# EAGLE design KMO_IO_MV2_9_min (EAGLE 9.5.1)

## Sheet 1 of 2
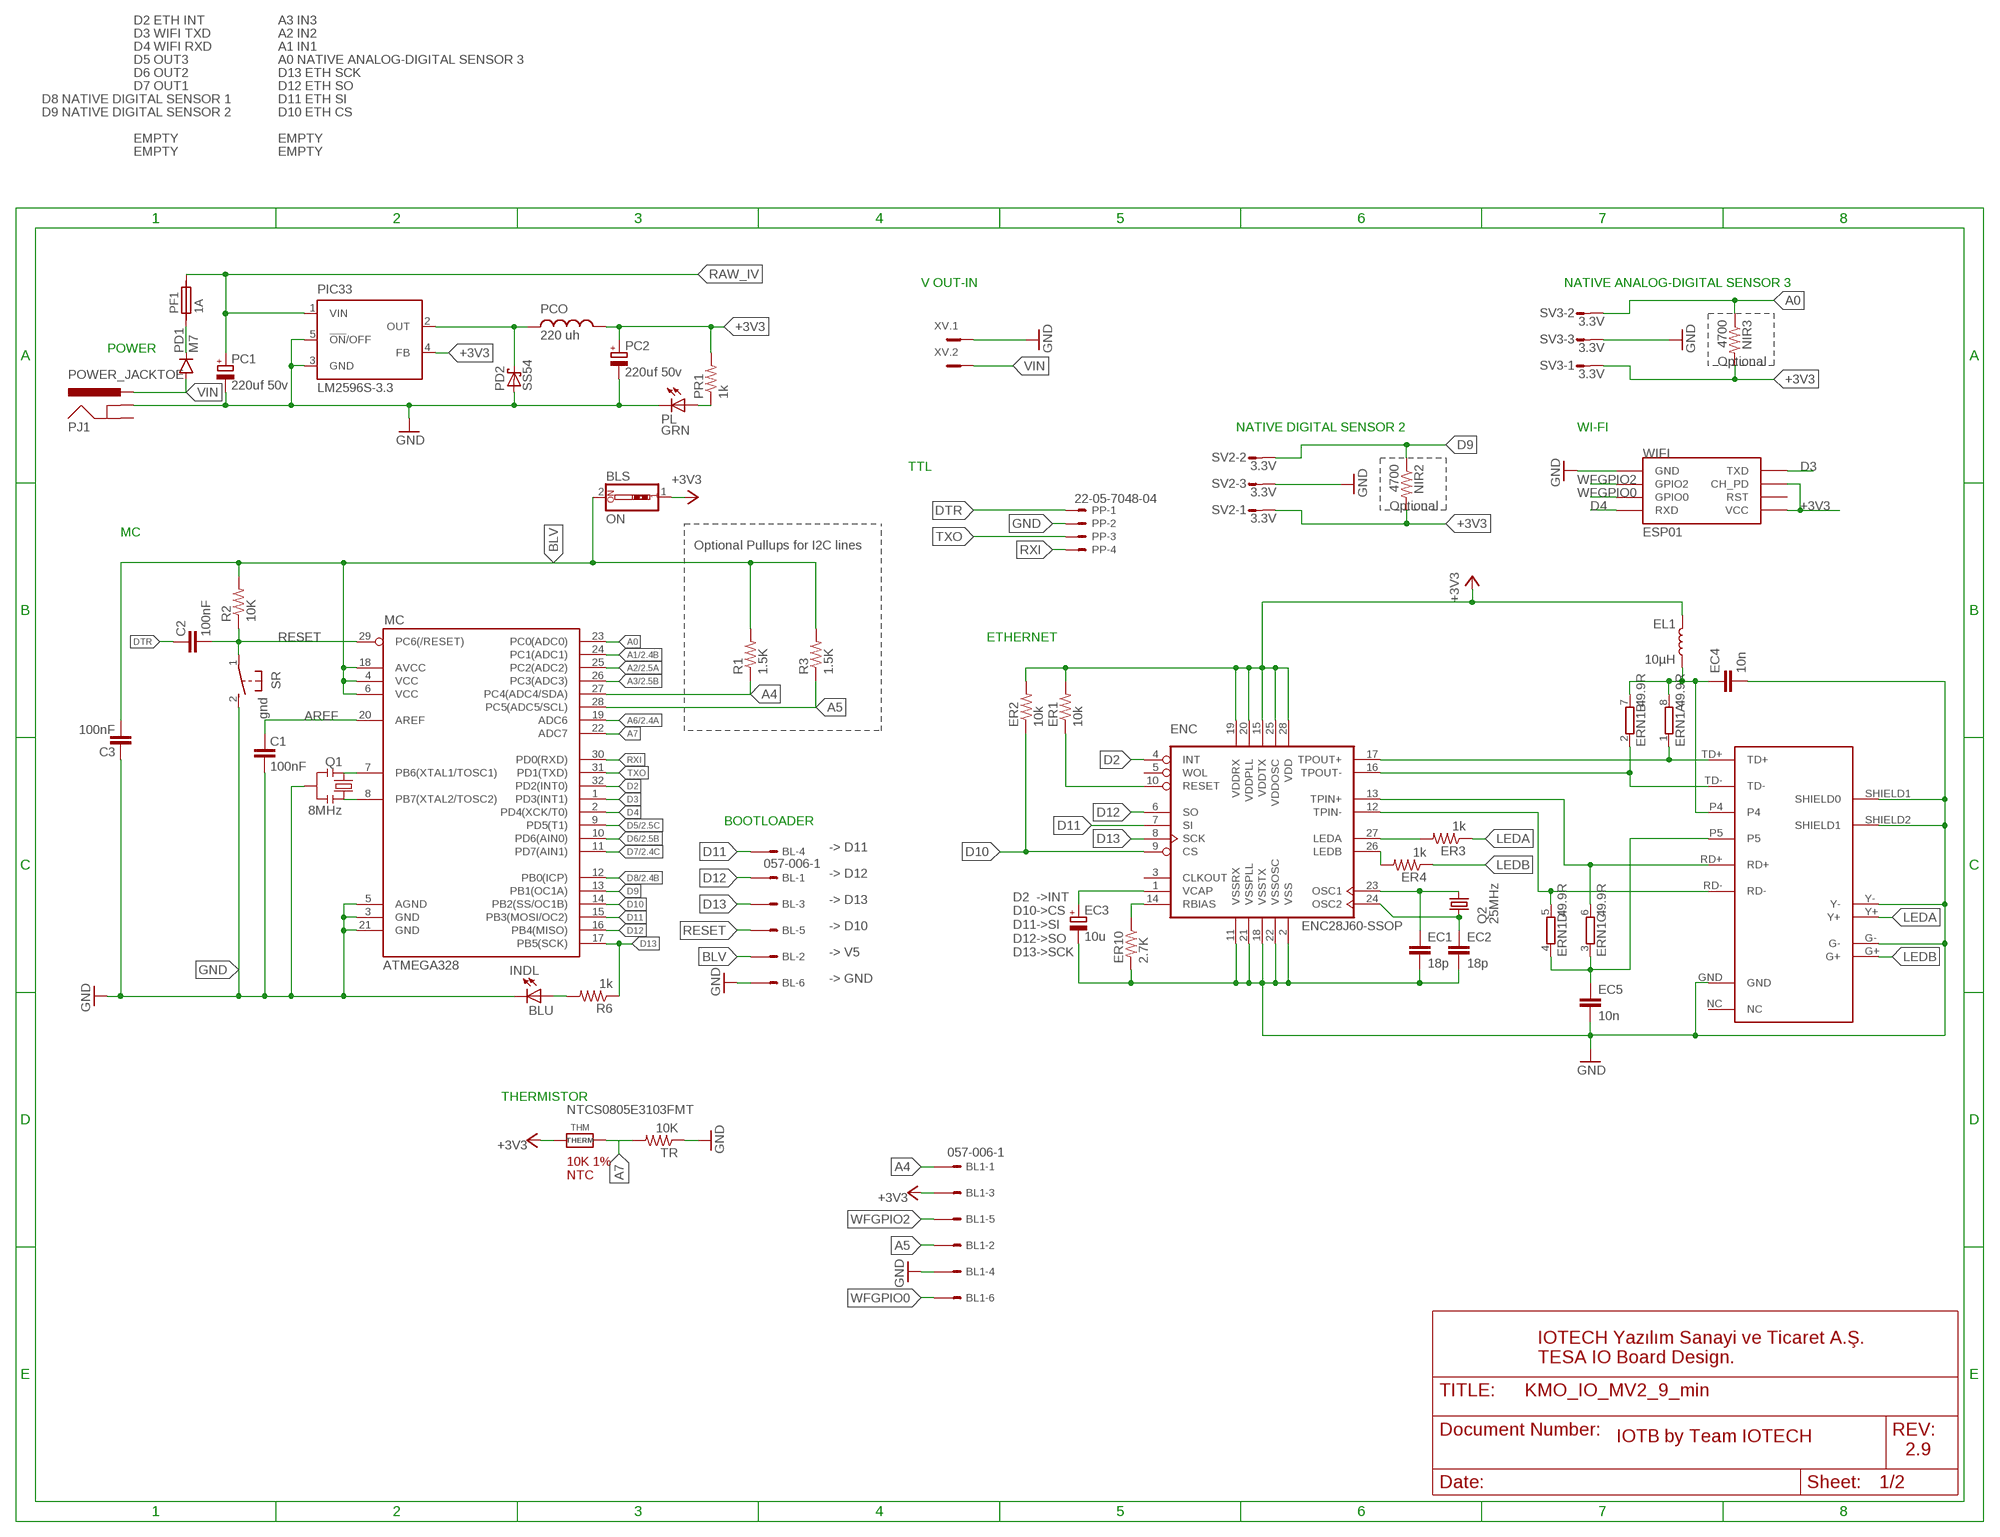
[diagram p0: schematic, sheet 1]

### Parts
BL  057-006-1  [057-006-1]
BL1  057-006-1  [057-006-1]
BLS  ON  SW_DIP-1  [EDG-01]
C1  100nF  CAP0805  [0805]
C2  100nF  CAP0805  [0805]
C3  100nF  CAP0805  [0805]
EC1  18p  CAP0805  [0805]
EC2  18p  CAP0805  [0805]
EC3  10u  CPOL-EUCT3216  [CT3216]
EC4  10n  CAP0805  [0805]
EC5  10n  CAP0805  [0805]
EL1  10µH  INDUCTOR-0805-3.3UH  [0805]
ENC  ENC28J60-SSOP  [SSOP28]
ER1  10k  RESISTOR0805-RES  [0805]
ER2  10k  RESISTOR0805-RES  [0805]
ER3  1k  RESISTOR0805-RES  [0805]
ER4  1k  RESISTOR0805-RES  [0805]
ER10  2.7K  RESISTOR0805-RES  [0805]
ERN1  49.9R  4R-N0603-ARV  [0603-ARV]
INDL  BLU  LEDCHIP-LED0805  [CHIP-LED0805]
MC  ATMEGA328  ATMEGA168  [TQFP32-08]
NIR2  4700  RESISTOR0805-RES  [0805]
NIR3  4700  RESISTOR0805-RES  [0805]
PC1  220uf 50v  CPOL-EU140CLH-1010  [140CLH-1010]
PC2  220uf 50v  CPOL-EU140CLH-1010  [140CLH-1010]
PCO  220 uh  MSS1260  [MSS1260]
PD1  M7  DIODESMA  [SMA-DIODE]
PD2  SS54  SCHOTTKY-DIODESMD  [SMB]
PF1  1A  SIBA194600  [1820]
PIC33  LM2596S-3.3  LM2596S  [TO263-5]
PJ1  POWER_JACKTOE  [POWER_JACK_SMD_OVERPASTE_TOE]
PL  GRN  LEDCHIP-LED0805  [CHIP-LED0805]
PP  22-05-7048-04  [7395-04]
PR1  1k  RESISTOR0805-RES  [0805]
Q1  8MHz  RESONATOR1:1  [RESONATOR-SMD-1:1]
Q2  25MHz  KX-9B  [5.0X3.2_2]
R1  1.5K  RESISTOR0805-RES  [0805]
R2  10K  RESISTOR0805-RES  [0805]
R3  1.5K  RESISTOR0805-RES  [0805]
R6  1k  RESISTOR0805-RES  [0805]
SR  gnd  31-XX  [B3F-31XX]
SV2  3.3V  S03P  [S03P]
SV3  3.3V  S03P  [S03P]
THM  THERM  MICROBUILDER_RESISTOR0805_NOTHERMALS  [MICROBUILDER_0805_NOTHERMALS]
TR  10K  RESISTOR0805-RES  [0805]
U$2  HR911105A  [RJ45]
WIFI  ESP01  [ESP01]
XV  MC2  [MC2]

### Nets
+3V3 [3.3 power line]: BL1.3 BLS.1 EL1.1 ENC.15(VDDTX) ENC.19(VDDRX) ENC.20(VDDPLL) ENC.25(VDDOSC) ENC.28(VDD) ER1.2 ER2.2 NIR2.2 NIR3.2 PC2.+ PCO.P$1 PIC33.4(FB) PR1.2 SV2.1 SV3.1 THM.1 WIFI.CH_PD WIFI.VCC ; also sheet 2
A0: MC.23(PC0(ADC0)) NIR3.1 SV3.2
A1: MC.24(PC1(ADC1)) ; also sheet 2
A2: MC.25(PC2(ADC2)) ; also sheet 2
A3: MC.26(PC3(ADC3)) ; also sheet 2
A4: BL1.1 MC.27(PC4(ADC4/SDA)) R1.1
A5: BL1.2 MC.28(PC5(ADC5/SCL)) R3.1
A6: MC.19(ADC6) ; also sheet 2
A7: MC.22(ADC7) THM.2 TR.2
AREF: C1.2 MC.20(AREF)
BLV: BL.2 BLS.2 C3.1 MC.4(VCC) MC.6(VCC) MC.18(AVCC) R1.2 R2.2 R3.2
D2: ENC.4(INT) MC.32(PD2(INT0))
D3: MC.1(PD3(INT1)) WIFI.TX(TXD)
D4: MC.2(PD4(XCK/T0)) WIFI.RX(RXD)
D5: MC.9(PD5(T1)) ; also sheet 2
D6: MC.10(PD6(AIN0)) ; also sheet 2
D7: MC.11(PD7(AIN1)) ; also sheet 2
D8: MC.12(PB0(ICP)) ; also sheet 2
D9: MC.13(PB1(OC1A)) NIR2.1 SV2.2
D10: ENC.9(CS) ER2.1 MC.14(PB2(SS/OC1B))
D11: BL.4 ENC.7(SI) MC.15(PB3(MOSI/OC2))
D12: BL.1 ENC.6(SO) MC.16(PB4(MISO))
D13: BL.3 ENC.8(SCK) MC.17(PB5(SCK)) R6.1
DTR: C2.2 PP.1
EP4: EC4.1 EL1.2 ERN1.7 ERN1.8 U$2.P4
EP5: EC5.1 ERN1.3 ERN1.4 U$2.P5
GND [3.3 power line]: BL1.4 BL.6 C1.1 C3.2 EC1.2 EC2.2 EC3.- EC4.2 EC5.2 ENC.2(VSS) ENC.11(VSSRX) ENC.18(VSSTX) ENC.21(VSSPLL) ENC.22(VSSOSC) ER10.2 INDL.C MC.3(GND) MC.5(AGND) MC.21(GND) PC1.- PC2.- PD2.A PIC33.3(GND) PIC33.5(!ON!/OFF) PJ1.GND(GNDBREAK) PL.C PP.2 Q1.2 SR.2(S) SV2.3 SV3.3 TR.1 U$2.G- U$2.GND U$2.SHIELD1(SHIELD0) U$2.SHIELD2(SHIELD1) U$2.Y- WIFI.GND XV.1 ; also sheet 2
LEDA: ER3.1 U$2.Y+
LEDB: ER4.1 U$2.G+
N$2: PD1.C PF1.1
N$5: INDL.A R6.2
N$9: ENC.27(LEDA) ER3.2
N$10: MC.8(PB7(XTAL2/TOSC2)) Q1.3
N$11: PL.A PR1.1
N$13: EC3.+ ENC.1(VCAP)
N$14: ENC.26(LEDB) ER4.2
N$15: MC.7(PB6(XTAL1/TOSC1)) Q1.1
N$16: PCO.P$2 PD2.C PIC33.2(OUT)
N$17: ENC.10(RESET) ER1.1
N$19: ENC.14(RBIAS) ER10.1
N$22: EC2.1 ENC.24(OSC2) Q2.1
N$24: EC1.1 ENC.23(OSC1) Q2.2
RAW_IV [vcc]: PC1.+ PF1.2 PIC33.1(VIN)
RD+: ENC.13(TPIN+) ERN1.6 U$2.RD+
RD-: ENC.12(TPIN-) ERN1.5 U$2.RD-
RESET: BL.5 C2.1 MC.29(PC6(/RESET)) R2.1 SR.1(P)
RXI: MC.30(PD0(RXD)) PP.4
TD+: ENC.17(TPOUT+) ERN1.1 U$2.TD+
TD-: ENC.16(TPOUT-) ERN1.2 U$2.TD-
TXO: MC.31(PD1(TXD)) PP.3
VIN: PD1.A PJ1.VIN0(PWR) XV.2
WFGPIO0: BL1.6 WIFI.GPIO0
WFGPIO2: BL1.5 WIFI.GPIO2
Unconnected: ENC.3(CLKOUT) ENC.5(WOL) PJ1.P$4(GND) U$2.NC WIFI.RST

### Notes on the sheet
- D2 ETH INT | A3 IN3
- D3 WIFI TXD | A2 IN2
- D4 WIFI RXD | A1 IN1
- D5 OUT3 | A0 NATIVE ANALOG-DIGITAL SENSOR 3
- D6 OUT2 | D13 ETH SCK
- D7 OUT1 | D12 ETH SO
- D8 NATIVE DIGITAL SENSOR 1 | D11 ETH SI
- D9 NATIVE DIGITAL SENSOR 2 | D10 ETH CS
- EMPTY | EMPTY
- EMPTY | EMPTY
- V OUT-IN | NATIVE ANALOG-DIGITAL SENSOR 3
- POWER
- Optional
- NATIVE DIGITAL SENSOR 2 | WI-FI
- TTL
- Optional
- MC
- Optional Pullups for I2C lines
- ETHERNET
- BOOTLOADER
- -> D11
- -> D12
- -> D13
- -> D10
- -> V5
- D2  ->INT
  D10->CS
  D11->SI
  D12->SO
  D13->SCK
- -> GND
- THERMISTOR
- NTCS0805E3103FMT
- 10K 1%
  NTC
- IOTECH Yazılım Sanayi ve Ticaret A.Ş.
  TESA IO Board Design.
- IOTB by Team IOTECH
- 2.9

## Sheet 2 of 2
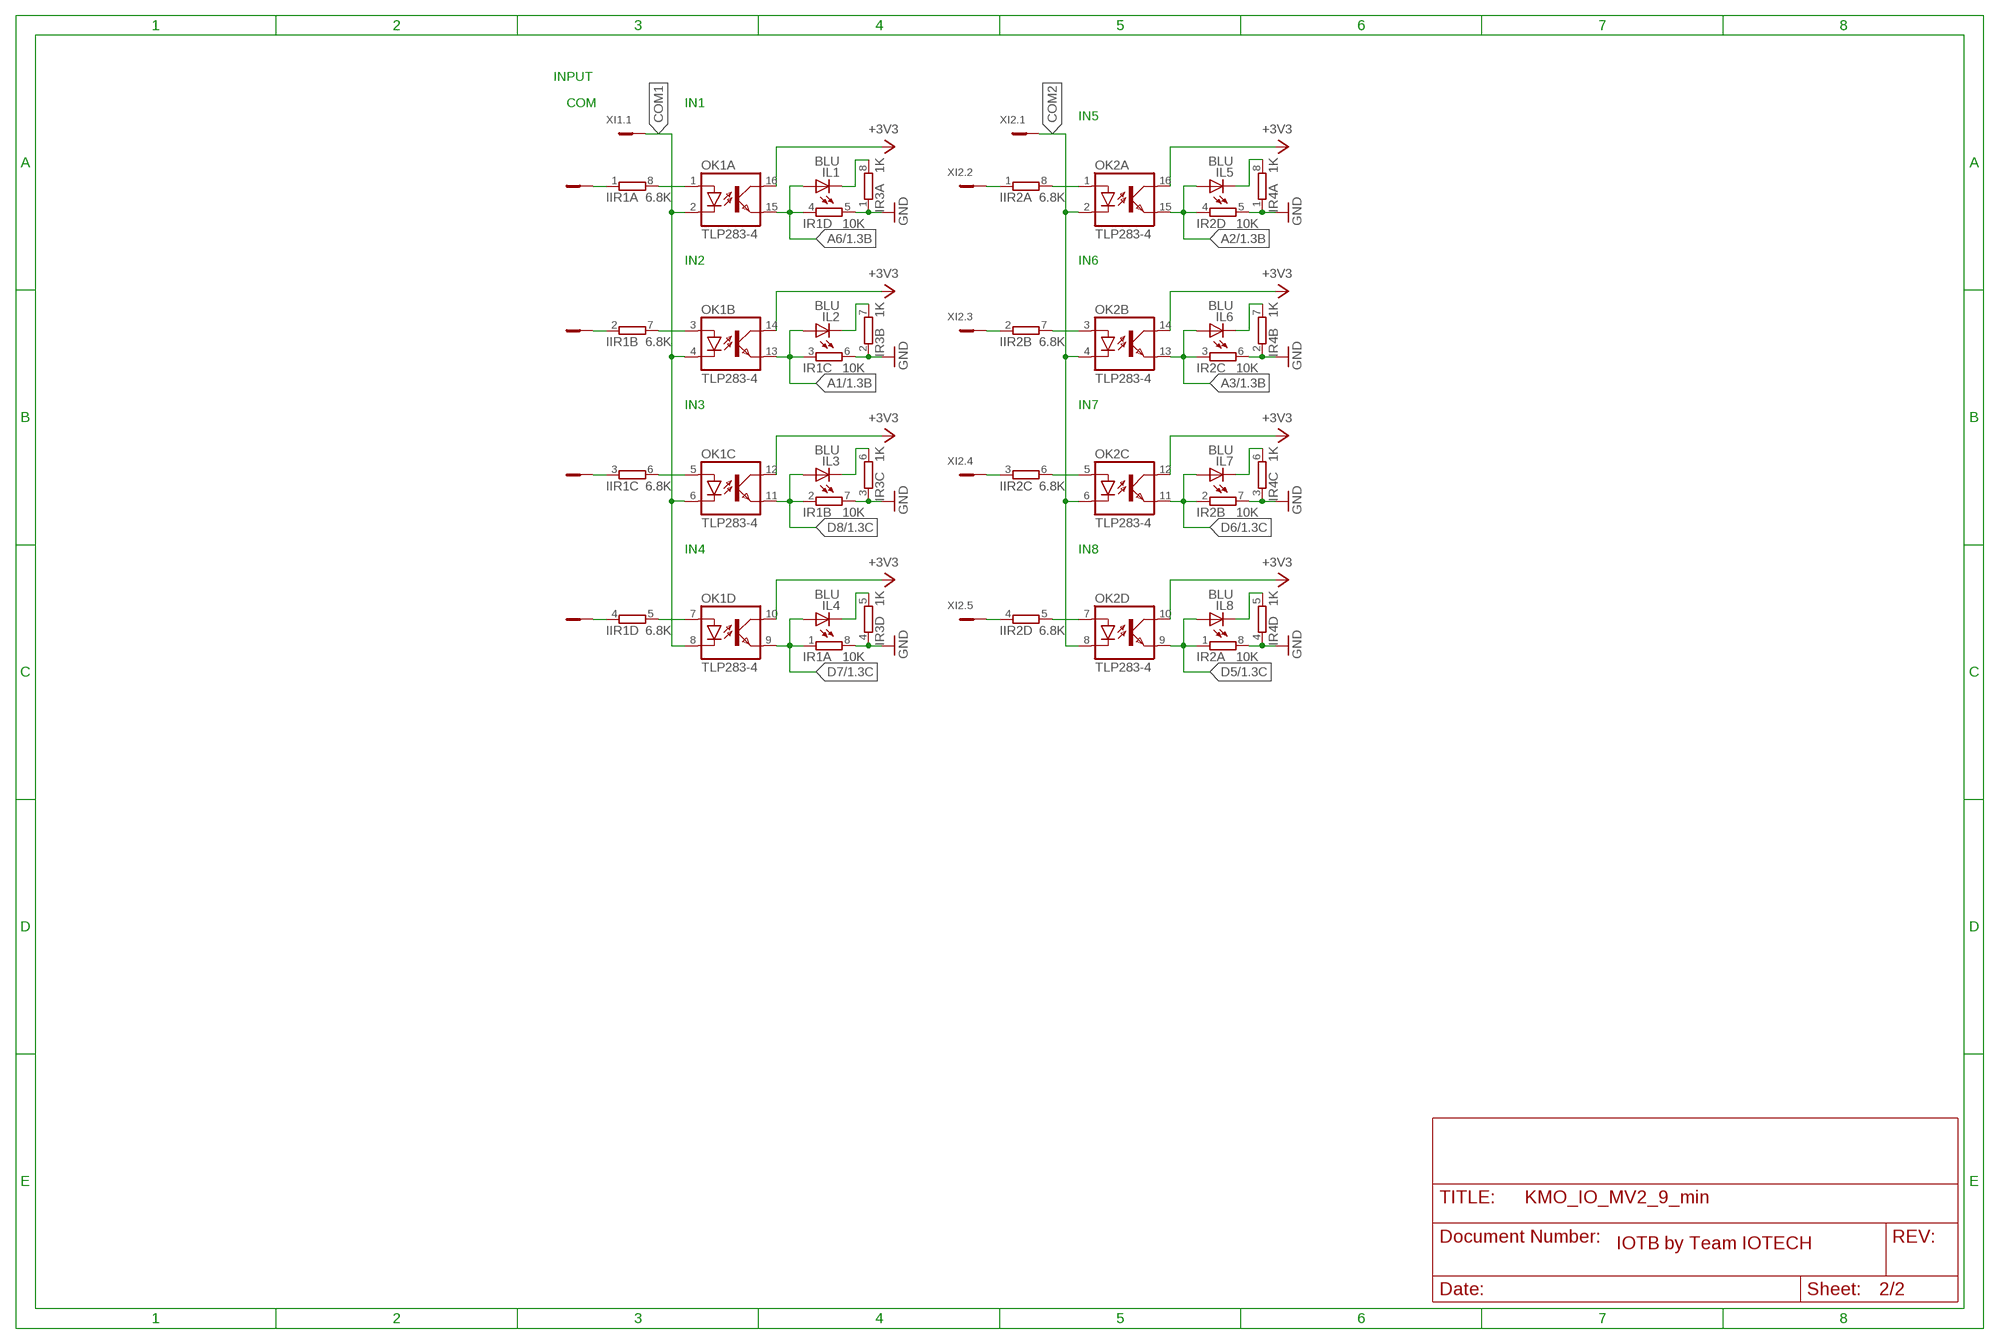
[diagram p1: schematic, sheet 2]

### Parts
IIR1  6.8K  4R-N0603-ARV  [0603-ARV]
IIR2  6.8K  4R-N0603-ARV  [0603-ARV]
IL1  BLU  LEDCHIP-LED0805  [CHIP-LED0805]
IL2  BLU  LEDCHIP-LED0805  [CHIP-LED0805]
IL3  BLU  LEDCHIP-LED0805  [CHIP-LED0805]
IL4  BLU  LEDCHIP-LED0805  [CHIP-LED0805]
IL5  BLU  LEDCHIP-LED0805  [CHIP-LED0805]
IL6  BLU  LEDCHIP-LED0805  [CHIP-LED0805]
IL7  BLU  LEDCHIP-LED0805  [CHIP-LED0805]
IL8  BLU  LEDCHIP-LED0805  [CHIP-LED0805]
IR1  10K  4R-N0603-ARV  [0603-ARV]
IR2  10K  4R-N0603-ARV  [0603-ARV]
IR3  1K  4R-N0603-ARV  [0603-ARV]
IR4  1K  4R-N0603-ARV  [0603-ARV]
OK1  TLP283-4  [MINI-FLAT-16]
OK2  TLP283-4  [MINI-FLAT-16]
XI1  MC5  [MC5]
XI2  MC5  [MC5]

### Nets
+3V3 [3.3 power line]: OK1.10(D:COL) OK1.12(C:COL) OK1.14(B:COL) OK1.16(A:COL) OK2.10(D:COL) OK2.12(C:COL) OK2.14(B:COL) OK2.16(A:COL) ; also sheet 1
A1: IL2.A IR1.3 OK1.13(B:EMIT) ; also sheet 1
A2: IL5.A IR2.4 OK2.15(A:EMIT) ; also sheet 1
A3: IL6.A IR2.3 OK2.13(B:EMIT) ; also sheet 1
A6: IL1.A IR1.4 OK1.15(A:EMIT) ; also sheet 1
COM1: OK1.2(A:C) OK1.4(B:C) OK1.6(C:C) OK1.8(D:C) XI1.1
COM2: OK2.2(A:C) OK2.4(B:C) OK2.6(C:C) OK2.8(D:C) XI2.1
D5: IL8.A IR2.1 OK2.9(D:EMIT) ; also sheet 1
D6: IL7.A IR2.2 OK2.11(C:EMIT) ; also sheet 1
D7: IL4.A IR1.1 OK1.9(D:EMIT) ; also sheet 1
D8: IL3.A IR1.2 OK1.11(C:EMIT) ; also sheet 1
GND [3.3 power line]: IR1.5 IR1.6 IR1.7 IR1.8 IR2.5 IR2.6 IR2.7 IR2.8 IR3.1 IR3.2 IR3.3 IR3.4 IR4.1 IR4.2 IR4.3 IR4.4 ; also sheet 1
N$12: IL1.C IR3.8
N$18: IIR1.1 XI1.2
N$20: IL2.C IR3.7
N$21: IL3.C IR3.6
N$23: IL4.C IR3.5
N$25: IL5.C IR4.8
N$26: IL6.C IR4.7
N$27: IL7.C IR4.6
N$28: IIR1.2 XI1.3
N$29: IIR1.8 OK1.1(A:A)
N$30: IIR1.7 OK1.3(B:A)
N$31: IIR1.6 OK1.5(C:A)
N$32: IIR1.5 OK1.7(D:A)
N$33: IIR1.3 XI1.4
N$34: IIR1.4 XI1.5
N$36: IIR2.1 XI2.2
N$37: IIR2.8 OK2.1(A:A)
N$38: IIR2.2 XI2.3
N$39: IIR2.7 OK2.3(B:A)
N$40: IIR2.3 XI2.4
N$41: IIR2.6 OK2.5(C:A)
N$42: IIR2.4 XI2.5
N$43: IIR2.5 OK2.7(D:A)
N$44: IL8.C IR4.5

### Notes on the sheet
- INPUT
- COM | IN1
- IN5
- IN2 | IN6
- IN3 | IN7
- IN4 | IN8
- IOTB by Team IOTECH

## Library data of the parts
BL BL1 = con-panduit:057-006-: CONNECTOR 6-pin series 057 contact pc board low profile headers; OC_FARNELL: unknown; OC_NEWARK: unknown
BLS = special:SW_DIP-1: DIP SWITCH
C1-C3 EC1 EC2 EC4 EC5 = SparkFun-Passives:CAP: Capacitor Standard 0603 ceramic capacitor, and 0.1" leaded capacitor.
EC3 PC1 PC2 = rcl:CPOL-EU: POLARIZED CAPACITOR, European symbol; SPICEPREFIX: C
EL1 = SparkFun-Coils:INDUCTOR: Inductors Resist changes in electrical current. Basically a coil of wire. SparkFun Products: SparkFun Load Cell Amplifier - HX711 <https://www.sparkfun.com/products/13879> IOIO-OTG - V2.2 <https://www.sparkfun.com/products/13613>; PROD_ID: NDUC-13076; VALUE: 3.3µH/±20%/450mA
ENC = microchip-enc28j60:ENC28J60-*: Microchip 10Mbit Eth. contoller with SPI interface
ER1-ER4 ER10 NIR2 NIR3 PR1 R1-R3 R6 TR = SparkFun-Passives:RESISTOR: Resistor Basic schematic elements and footprints for 0603, 1206, and PTH resistors.
ERN1 IIR1 IIR2 IR1-IR4 = resistor-dil:4R-N: Array Chip Resistor Source: RS Component / Phycomp; OC_FARNELL: unknown; OC_NEWARK: unknown
IL1-IL8 INDL PL = led:LED: LED OSRAM: - CHIPLED LG R971, LG N971, LY N971, LG Q971, LY Q971, LO R971, LY R971 LH N974, LH R974 LS Q976, LO Q976, LY Q976 LO Q996 - Hyper CHIPLED LW Q18S LB Q993, LB Q99A, LB R99A - SideLED LS A670, LO A670, LY A670, LG A670, LP A670 LB A673, LV A673, LT A673, LW A673 LH A674 LY A675 LS A676, LA A676, LO A676, LY A676, LW A676 LS A679, LY A679, LG A679 - Hyper Micro SIDELED® LS Y876, LA Y876, LO Y876, LY Y876 LT Y87S - SmartLED LW L88C, LW L88S LB L89C, LB L89S, LG L890 LS L89K, LO L89K, LY L89K LS L896, LA L896, LO L896, LY L896 - TOPLED LS T670, LO T670, LY T670, LG T670, LP T670 LSG T670, LSP T670, LSY T670, LOP T670, LYG T670 LG T671, LOG T671, LSG T671 LB T673, LV T673, LT T673, LW T673 LH T674 LS T676, LA T676, LO T676, LY T676, LB T676, LH T676, LSB T676, LW T676 LB T67C, LV T67C, LT T67C, LS T67K, LO T67K, LY T67K, LW E67C LS E67B, LA E67B, LO E67B, LY E67B, LB E67C, LV E67C, LT E67C LW T67C LS T679, LY T679, LG T679 LS T770, LO T770, LY T770, LG T770, LP T770 LB T773, LV T773, LT T773, LW T773 LH T774 LS E675, LA E675, LY E675, LS T675 LS T776, LA T776, LO T776, LY T776, LB T776 LHGB T686 LT T68C, LB T68C - Hyper Mini TOPLED® LB M676 - Mini TOPLED Santana® LG M470 LS M47K, LO M47K, LY M47K Source: http://www.osram.convergy.de LUXEON: - LUMILED® LXK2-PW12-R00, LXK2-PW12-S00, LXK2-PW14-U00, LXK2-PW14-V00 LXK2-PM12-R00, LXK2-PM12-S00, LXK2-PM14-U00 LXK2-PE12-Q00, LXK2-PE12-R00, LXK2-PE12-S00, LXK2-PE14-T00, LXK2-PE14-U00 LXK2-PB12-K00, LXK2-PB12-L00, LXK2-PB12-M00, LXK2-PB14-N00, LXK2-PB14-P00, LXK2-PB14-Q00 LXK2-PR12-L00, LXK2-PR12-M00, LXK2-PR14-Q00, LXK2-PR14-R00 LXK2-PD12-Q00, LXK2-PD12-R00, LXK2-PD12-S00 LXK2-PH12-R00, LXK2-PH12-S00 LXK2-PL12-P00, LXK2-PL12-Q00, LXK2-PL12-R00 Source: www.luxeon.com KINGBRIGHT: KA-3528ASYC Source: www.kingbright.com
MC = SparkFun:ATMEGA168
OK1 OK2 = optocoupler:TLP283-4: TOSHIBA PHOTOCOUPLER GaAs IRED & PHOTO-TRANSISTOR Source: http://www.semicon.toshiba.co.jp/td/en/Opto/Photocoupler/en_20050928_TLP283_datasheet.pdf; OC_FARNELL: unknown; OC_NEWARK: unknown; SPICEPREFIX: O
PCO = inductor-coilcraft:MSS1260: SMT Power Inductor
PD1 = SparkFun-DiscreteSemi:DIODE: Diode These are standard reverse protection diodes and small signal diodes. SMA package can handle up to about 1A. SOD-323 can handle about 200mA. What the SOD-323 package when ordering, there are some mfgs out there that are 5-pin packages.
PD2 = diode:SCHOTTKY-DIODE: Schottky Diode
PF1 = _hhn_PtcFuses_Siba_r500_Ozan:SIBA194600*: SIBA PTC-Fuses, Series 194600, 1812 (4.5 3.2)mm Source: www.siba.de/ Package: SMD 1812 (4.5 x 3.2)mm Technologies: SIBA194600Axxx xxx: Trip-Current * 10 mA Author: Dipl.-Ing. FH Rainer Bayer
PIC33 = national-semiconductor:LM2596: SIMPLE SWITCHER® Power Converter 150 kHz 3A Step-Down Voltage Regulator Source: http://www.national.com/ds/LM/LM2596.pdf; MF: NATIONAL SEMICONDUCTOR; MPN: LM2596S-ADJ/NOPB; OC_FARNELL: 9494367; OC_NEWARK: 41K3842; SPICEPREFIX: X
PJ1 = SparkFun-Connectors:POWER_JACK: Power Jack Connector This is the standard 5.5mm barrel jack for power. The PTH is the most common, proven, reliable, footprint. The Slot footprint only works if the mill layer is transmitted to the PCB fab house so be warned. Here are the connectors we sell at SparkFun: DC Barrel Power Jack/Connector <https://www.sparkfun.com/products/119> (PRT-00119) DC Barrel Power Jack/Connector (SMD) <https://www.sparkfun.com/products/12748> (PRT-12748) DC Barrel Jack Adapter - Breadboard Compatible <https://www.sparkfun.com/products/10811> (PRT-10811) It is used on this SparkFun product (and many, many others): SparkFun RedBoard - Programmed with Arduino <https://www.sparkfun.com/products/12757> (DEV-12757) Also, if you need a mating power supply or connector, please check these out: Wall Adapter Power Supply - 9VDC 650mA <https://www.sparkfun.com/products/298> (TOL-00298) DC Barrel Jack Adapter - Male <https://www.sparkfun.com/products/10287> (PRT-10287); PROD_ID: CONN-08106; SF_ID: PRT-12748
PP = con-molex:22-?-04: CONNECTOR wire to board 2.54 mm (.1 inch) pitch header; MF: MOLEX; OC_FARNELL: unknown; OC_NEWARK: unknown
Q1 = Testing:RESONATOR: Resonator Small SMD resonator. This is the itty bitty 10/20MHz resonators with built in caps. CSTCE10M0G55 and CSTCE20M0V53. Footprint for SMD has been used in SFE production for years, and does work okay. 1:1 is an attempt to get larger fillets on the sides so it will be easier to inspect these solders in our AOI machine. The pads have been minimized to match the actual metal under the resonator. To see this relation, it includes an image import of the bottom side of the component. Imported to scale on layer 200.
Q2 = crystal-geyer_V1_0:KX: Quartz Crystals (MHz) SMD: KX - Serie Model Size l/w/h [mm] Frequency Range Frequency Stability Temp. Range [°C] Load Capacitance AECQ 200 availabel Datasheet KX-4 KX-5 KX-6 KX-7 KX-9A KX-9B KX-12A KX-12B KX-13 KX-20 KX-K KX-KS 1.6/1.2/0.3 2.0/1.6/0.45 2.5/2.0/0.55 3.2/2.5/0.8 5.0/3.2/1.0 5.0/3.2/1.1 6.0/3.5/1.1 6.0/3.5/1.0 7.0/5.0 /1.3 11.6/5.5/1.6 12.3/4.5/4.2 12.3/4.5/3.2 24.0 ~ 80.0 MHz 16.0 ~ 80.0 MHz 12.0 ~ 80.0 MHz 8.0 ~ 60.0 MHz 7,68 ~ 300,0 MHz 8,0 ~ 50,0 MHz 8,0 ~ 150,0 MHz 8,0 ~ 50,0 MHz 6,0 ~ 160,0 MHz 3,579 ~ 25,0 MHz 3,579 ~ 70,0 MHz 3,579 ~ 70,0 MHz ±10 … ±50ppm ±10 … ±50ppm ±10 … ±50ppm ±10 … ±50ppm ±10 … ±50ppm ±10 … ±50ppm ±10 … ±50ppm ±10 … ±50ppm ±10 … ±50ppm ±50ppm ±10 … ±50ppm ±10 … ±50ppm (*) -40°C …+85°C (*) -40°C …+125°C (*) -40°C …+125°C (*) -40°C …+125°C (*) -40°C …+105°C (*) -40°C …+105°C (*) -40°C …+125°C (*) -40°C …+105°C (*) -40°C …+105°C (*) -40°C …+105°C (*) -40°C …+85°C (*) -40°C …+85°C 8, 8…16 8, 8…16 10, 8…16 12, 7…20 16, 10…20 16, 10…20 16, 10…20 16, 12…20 16, 12…20 16, 12…20 16, 12…30 16, 12…30 - yes yes yes - - - - - - - - KX-4.pdf <http://www.geyer-electronic.de/uploads/tx_userartikelfrequenz/GEYER-KX-4.pdf> KX-5.pdf <http://www.geyer-electronic.de/uploads/tx_userartikelfrequenz/GEYER-KX-5.pdf> KX-6.pdf <http://www.geyer-electronic.de/uploads/tx_userartikelfrequenz/GEYER-KX-6.pdf> KX-7.pdf <http://www.geyer-electronic.de/uploads/tx_userartikelfrequenz/GEYER-KX-7.pdf> KX-9A.pdf <http://www.geyer-electronic.de/uploads/tx_userartikelfrequenz/GEYER-KX-9A.pdf> KX-9B.pdf <http://www.geyer-electronic.de/uploads/tx_userartikelfrequenz/GEYER-KX-9B.pdf> KX-12A.pdf <http://www.geyer-electronic.de/uploads/tx_userartikelfrequenz/GEYER-KX-12A.pdf> KX-12B.pdf <http://www.geyer-electronic.de/uploads/tx_userartikelfrequenz/GEYER-KX-12B.pdf> KX-13.pdf <http://www.geyer-electronic.de/uploads/tx_userartikelfrequenz/GEYER-KX-13.pdf> KX-20.pdf <http://www.geyer-electronic.de/uploads/tx_userartikelfrequenz/GEYER-KX-20.pdf> KX-K.pdf <http://www.geyer-electronic.de/uploads/tx_userartikelfrequenz/GEYER-KX-K.pdf> KX-KS.pdf <http://www.geyer-electronic.de/uploads/tx_userartikelfrequenz/GEYER-KX-KS.pdf> <http://www.geyer-electronic.de/fileadmin/template/img/logo-geyer-electronic.png> Details see: http://www.geyer-electronic.de/Frequenz-Produkte.9.0.html Created 2016-06-07, Hans Locher 2016 (C) Geyer Quartz Technology KX4,KX5,KX6,KX7,KX9A,KX9B,KX12A,KX12B,KX13,KX20,KXK,KXKS;1612;2016;2520;3225;5032;6035;7050;11655;12345;1,6x1,2;2,0x1,6;2,5x2,0;3,2x2,5;5,0x3,2;6,0x3,5;7,0x5,0;11,6x5,5;12,3x4,5;12,3x4,5;1.6x1.2;2.0x1.6;2.5x2.0;3.2x2.5;5.0x3.2;6.0x3.5;7.0x5.0;11.6x5.5;12.3x4.5;12.3x4.5;
SR = switch-omron:31-XX: OMRON SWITCH; MPN: B3F-3100; OC_FARNELL: 959704; OC_NEWARK: 36M3582
SV2 SV3 = con_io_sxp:S03P: AMP MT CONNECTOR
THM = Adafruit Circuit Playground Express:MICROBUILDER_RESISTOR: Resistors For new designs, use the packages preceded by an '_' character since they are more reliable: The following footprints should be used on most boards: _0402 - Standard footprint for regular board layouts _0603 - Standard footprint for regular board layouts _0805 - Standard footprint for regular board layouts _1206 - Standard footprint for regular board layouts For extremely tight-pitch boards where space is at a premium, the following 'micro-pitch' footprints can be used (smaller pads, no silkscreen outline, etc.): _0402MP - Micro-pitch footprint for very dense/compact boards _0603MP - Micro-pitch footprint for very dense/compact boards _0805MP - Micro-pitch footprint for very dense/compact boards _1206MP - Micro-pitch footprint for very dense/compact boards
U$2 = HR911105A:HR911105A
WIFI = esp8266modules:ESP01: ESP8266 Wifi module 01
XI1 XI2 = con-phoenix-381_l:MC5: Mini-Combicon 3.81mm horizontal 5-polig (ohne Gegenstecker)
XV = con-phoenix-381_l:MC2: Mini-Combicon 3.81mm horizontal 2-polig (ohne Gegenstecker)

## Net classes
0 default: width 0.203 mm, drill 0.3 mm, clearance 0.16 mm
1 vcc: width 0.254 mm, drill 0.3 mm, clearance 0.16 mm
2 3.3 power line: width 0.254 mm, drill 0.3 mm, clearance 0.16 mm
3 outsise power line: width 0.254 mm, drill 0.3 mm, clearance 0.16 mm

## Board
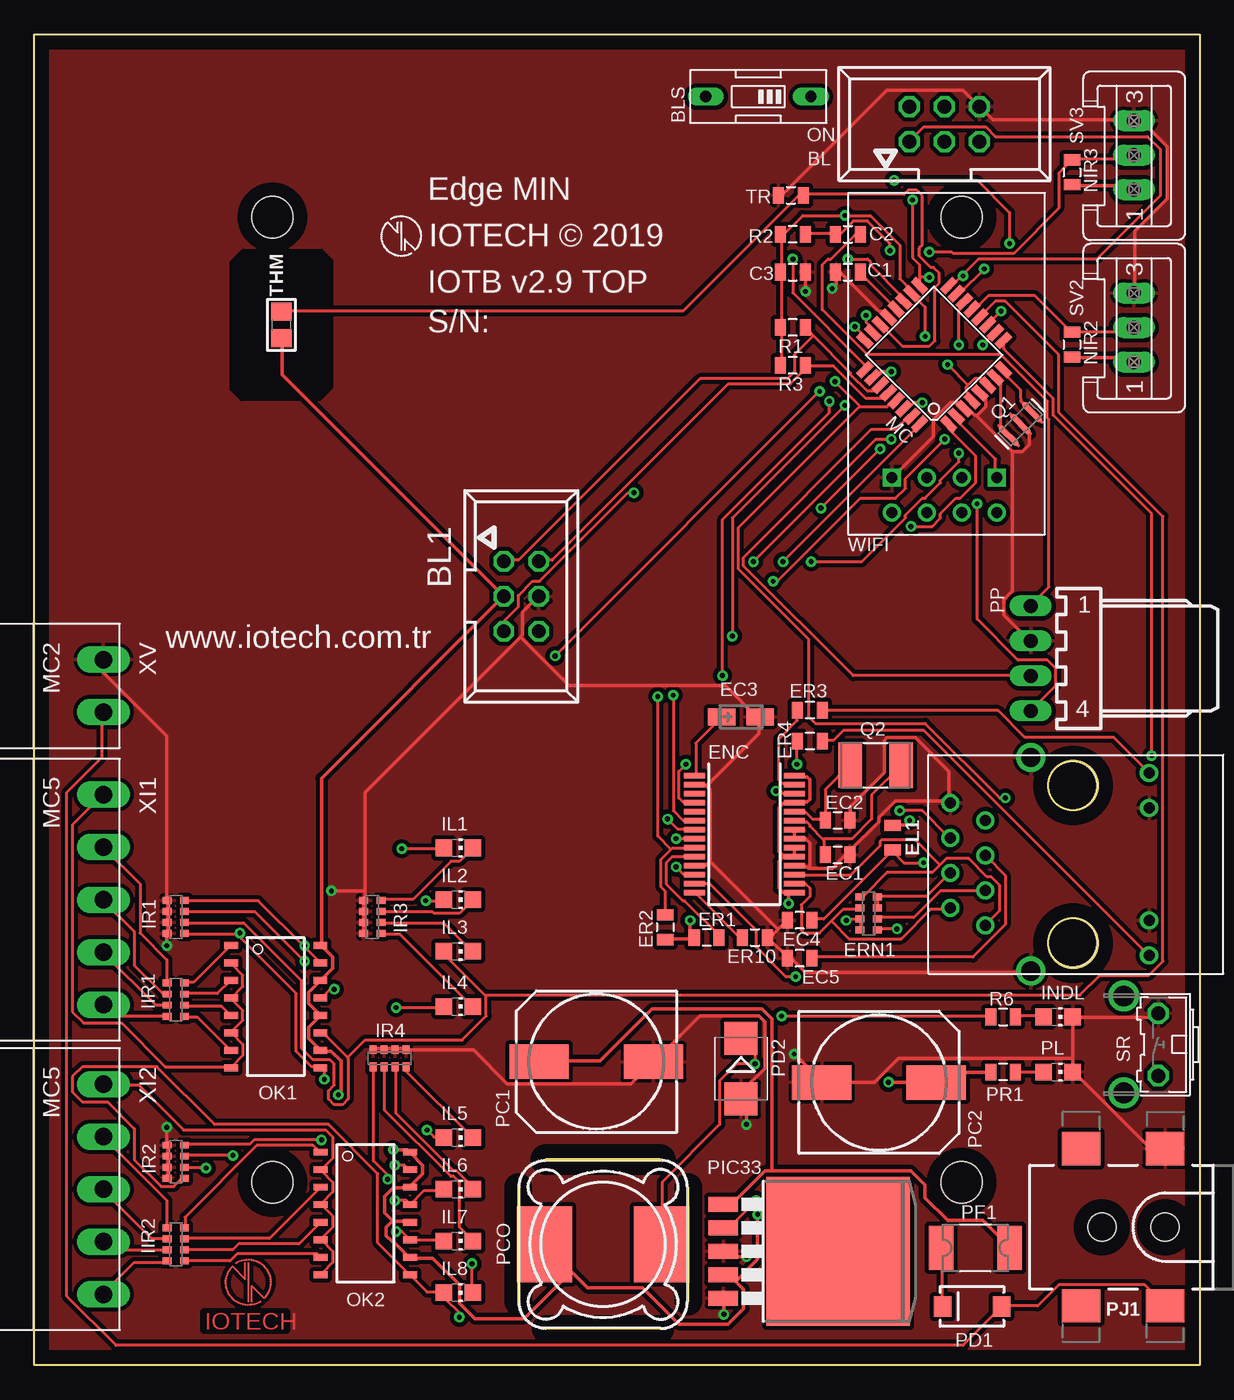
[diagram p2: board, top side]
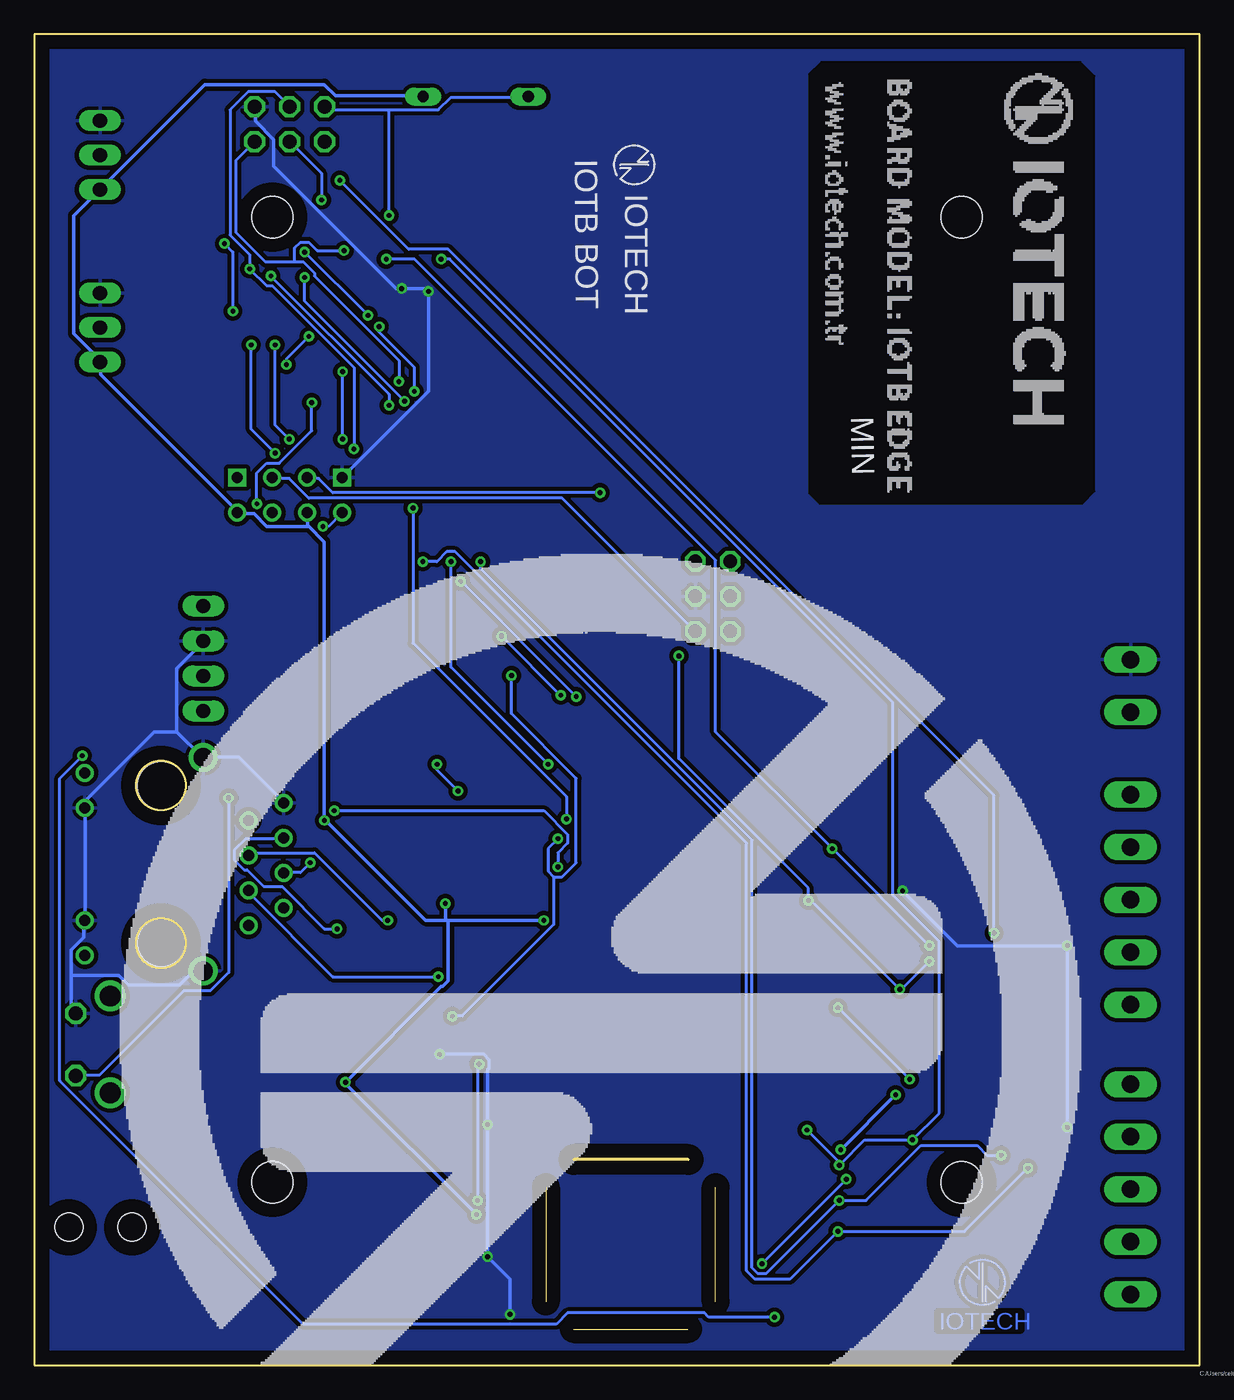
[diagram p3: board, bottom side, seen from below]

Size 84.5 x 96.5 mm. Coordinates in mm from the lower left corner, seen from the top.
Outline: 0,0 0,96.5 84.5,96.5 84.5,0 0,0
Copper layers (1*16): Top 0.035mm / dielectric 1.5mm / Bottom 0.035mm
Design rules "KMO_IO_M": minimum track width 6mil, minimum drill 0.35mm, track to track 0.205mm, track to pad 0.205mm, pad to pad 0.205mm, via to via 0.205mm, smd to smd 6mil, copper to edge 40mil, drill to drill 6mil, minimum pad ring 10mil, minimum via ring 8mil, stop-mask expansion 4mil, vias tented up to drill 0mil, thermal gap 10mil
Holes 3 mm at 17.25,83.25 67.25,83.25 17.25,13.25 67.25,13.25

### Footprints (pad centres in the part's own frame; a part is rotated, then mirrored left to right if it is on the bottom)
057-006-1 = drill 1 octagon: 1 -2.54,-1.27; 2 -2.54,1.27; 3 0,-1.27; 4 0,1.27; 5 2.54,-1.27; 6 2.54,1.27
EDG-01 = drill 0.813 long: 1 0,-3.81; 2 0,3.81
0805 = smd 0.8 x 1.2: 1 -0.9,0; 2 0.9,0
CT3216 = smd 2 x 1.2: + -1.4,0; - 1.4,0
SSOP28 = smd 0.4 x 1.5: 1 -4.225,-3.625; 2 -3.575,-3.625; 3 -2.925,-3.625; 4 -2.275,-3.625; 5 -1.625,-3.625; 6 -0.975,-3.625; 7 -0.325,-3.625; 8 0.325,-3.625; 9 0.975,-3.625; 10 1.625,-3.625; 11 2.275,-3.625; 12 2.925,-3.625; 13 3.575,-3.625; 14 4.225,-3.625; 15 4.225,3.625; 16 3.575,3.625; 17 2.925,3.625; 18 2.275,3.625; 19 1.625,3.625; 20 0.975,3.625; 21 0.325,3.625; 22 -0.325,3.625; 23 -0.975,3.625; 24 -1.625,3.625; 25 -2.275,3.625; 26 -2.925,3.625; 27 -3.575,3.625; 28 -4.225,3.625
0603-ARV = smd 0.5 x 0.65: 1 -1.2,-0.625; 2 -0.4,-0.625; 3 0.4,-0.625; 4 1.2,-0.625; 5 1.2,0.625; 6 0.4,0.625; 7 -0.4,0.625; 8 -1.2,0.625
CHIP-LED0805 = smd 1.2 x 1.2: A 0,-1.05; C 0,1.05
TQFP32-08 = smd 1.27 x 0.559: 1 -4.293,2.8; 2 -4.293,2; 3 -4.293,1.2; 4 -4.293,0.4; 5 -4.293,-0.4; 6 -4.293,-1.2; 7 -4.293,-2; 8 -4.293,-2.8; 17 4.293,-2.8; 18 4.293,-2; 19 4.293,-1.2; 20 4.293,-0.4; 21 4.293,0.4; 22 4.293,1.2; 23 4.293,2; 24 4.293,2.8 | smd 0.559 x 1.27: 9 -2.8,-4.293; 10 -2,-4.293; 11 -1.2,-4.293; 12 -0.4,-4.293; 13 0.4,-4.293; 14 1.2,-4.293; 15 2,-4.293; 16 2.8,-4.293; 25 2.8,4.293; 26 2,4.293; 27 1.2,4.293; 28 0.4,4.293; 29 -0.4,4.293; 30 -1.2,4.293; 31 -2,4.293; 32 -2.8,4.293
MINI-FLAT-16 = smd 1 x 0.5: 1 -3.24,4.445; 2 -3.24,3.175; 3 -3.24,1.905; 4 -3.24,0.635; 5 -3.24,-0.635; 6 -3.24,-1.905; 7 -3.24,-3.175; 8 -3.24,-4.445; 9 3.24,-4.445; 10 3.24,-3.175; 11 3.24,-1.905; 12 3.24,-0.635; 13 3.24,0.635; 14 3.24,1.905; 15 3.24,3.175; 16 3.24,4.445
140CLH-1010 = smd 4.3 x 2.5: + 4.15,0; - -4.15,0
MSS1260 = smd 5.5 x 4: P$1 0,4.25; P$2 0,-4.25
SMA-DIODE = smd 1.27 x 1.47: A -2.15,0; C 2.15,0
SMB = smd 2.4 x 2.4: A 2.2,0; C -2.2,0
1820 = smd 1.78 x 3.2: 1 -2.49,0; 2 2.49,0
TO263-5 = smd 1.067 x 2.159: 1 -3.404,-5.791; 2 -1.702,-5.791; 3 0,-5.791; 4 1.702,-5.791; 5 3.404,-5.791 | smd 10.8 x 10.41: 6 0,2.54
POWER_JACK_SMD_OVERPASTE_TOE = smd 2.8 x 2.4: GND 0,-5.7; P$4 6.1,-5.7; VIN0 0,5.7; VIN1 6.1,5.7 | hole 2.032: 0,0; 4.572,0
7395-04 = drill 1.016 long: 1 3.81,0; 2 1.27,0; 3 -1.27,0; 4 -3.81,0
RESONATOR-SMD-1:1 = smd 0.45 x 1.905: 1 -1.2,0; 2 0,0; 3 1.2,0
5.0X3.2_2 = smd 1.7 x 3.3: 1 -1.85,0; 2 1.85,0
B3F-31XX = drill 1.016 octagon: 1 -2.261,-1.245; 2 2.261,-1.245 | drill 1.499 pad 2.159: 3 -3.505,1.245; 4 3.505,1.245
S03P = drill 1.016 long: 1 2.5,0; 2 0,0; 3 -2.5,0
MICROBUILDER_0805_NOTHERMALS = smd 1.3 x 1.5: 1 -0.95,0; 2 0.95,0
RJ45 = drill 0.8: G+ 5.84,-6.305; G- 5.84,-3.765; GND -8.57,4.76; NC -6.03,3.5; P4 -8.57,-0.32; P5 -6.03,0.96; RD+ -6.03,-1.58; RD- -8.57,2.22; TD+ -6.03,-4.12; TD- -8.57,-2.86; Y+ 5.84,6.945; Y- 5.84,4.405 | drill 1.4: SHIELD1 -2.73,-7.425; SHIELD2 -2.73,8.065 | hole 3.5: 0.3,-5.38; 0.3,6.02
ESP01 = drill 0.8: CH_PD -1.285,-8.178; GPIO0 1.255,-5.638; GPIO2 -1.285,-5.638; RST 1.255,-8.178; TX -3.825,-8.178; VCC 3.795,-8.178 | drill 0.8 square: GND -3.825,-5.638; RX 3.795,-5.638
MC5 = drill 1.27 long: 1 -7.62,0; 2 -3.81,0; 3 0,0; 4 3.81,0; 5 7.62,0
MC2 = drill 1.27 long: 1 -1.905,0; 2 1.905,0

### Placement (x,y rotation side)
BL  66,90 0 top
BL1  35.31,55.75 270 top
BLS  52.5,92 90 top
C1  59,79.26 0 top
C2  59,82.01 0 top
C3  55,79.26 0 top
EC1  58.25,37 0 top
EC2  58.25,39.5 0 top
EC3  51.25,47 0 top
EC4  55.5,32.25 180 top
EC5  55.5,29.5 180 top
EL1  62.25,38.25 270 top
ENC  51.5,38.5 270 top
ER1  48.75,31 180 top
ER2  45.75,31.75 270 top
ER3  56.25,47.5 180 top
ER4  56.25,45.25 180 top
ER10  52.25,31 0 top
ERN1  60.5,32.75 270 top
IIR1  10.25,26.5 270 top
IIR2  10.25,8.75 270 top
IL1  30.75,37.5 270 top
IL2  30.75,33.75 270 top
IL3  30.75,30 270 top
IL4  30.75,26 270 top
IL5  30.75,16.5 270 top
IL6  30.75,12.75 270 top
IL7  30.75,9 270 top
IL8  30.75,5.25 270 top
INDL  74.25,25.25 270 top
IR1  10.25,32.5 90 top
IR2  10.25,14.75 90 top
IR3  24.5,32.5 270 top
IR4  25.75,22.25 180 top
MC  65.25,73.26 135 top
NIR2  75.25,74 270 top
NIR3  75.25,86.5 270 top
OK1  17.5,26 0 top
OK2  24,11 0 top
PC1  40.75,22 180 top
PC2  61.25,20.5 0 top
PCO  41.25,8.75 90 top
PD1  68,4.25 180 top
PD2  51.25,21.5 270 top
PF1  68.25,8.5 0 top
PIC33  55.75,8.25 270 top
PJ1  82,10 180 top
PL  74.25,21.25 270 top
PP  72.25,51.25 90 top
PR1  70.25,21.25 180 top
Q1  71.5,68.26 45 top
Q2  61,43.5 0 top
R1  55,75.25 180 top
R2  55,82.01 180 top
R3  55,72.5 180 top
R6  70.25,25.25 0 top
SR  80.25,23.25 90 top
SV2  79.75,75.25 270 top
SV3  79.75,87.75 270 top
THM  17.91,75.44 90 top
TR  54.86,84.84 0 top
U$1  [IOTECH_COPPER_W_TEXT]  15.5,6 0 top
U$2  75,36 0 top
U$4  [IOTECH_COPPER_W_TEXT]  15.75,6 0 bottom
WIFI  66,70 0 top
XI1  5,33.75 270 top
XI2  5,12.75 270 top
XV  5,49.25 270 top

### Tracks (layer width: path | path; a pad name or v marks a point on that pad's centre or on a via)
+3V3  (via drill 0.35)
  Top 0.254: THM.1 17.96,74.39 17.96,71.84 33.98,55.82 BL1.3 33.98,55.72 20.82,42.55 20.82,30.51 OK1.16 20.82,30.41 21.64,29.59 21.64,28.78 20.82,27.96 OK1.14 20.72,27.86 19.9,27.04 19.9,26.23 20.72,25.41 OK1.12 20.72,25.31 19.9,24.49 19.9,23.68 20.72,22.86 OK1.10 20.82,22.76 21.53,22.76 22.25,22.04 22.25,19.8 v22.04,19.59 | NIR2.2 75.31,73.07 79.39,73.07 79.7,72.76 SV2.1 | NIR3.2 75.31,85.52 79.5,85.52 79.7,85.31 SV3.1 | 25.92,10.41 25.51,10 25.51,9.39 25.92,8.98 26.02,8.98 27.14,7.86 OK2.10 27.35,7.76 28.88,7.76 30.82,5.82 30.82,4.49 31.94,3.37 35.51,3.37 38.88,6.74 PCO.P$1 37.04,8.67 40.11,5.61 44.09,5.61 46.74,2.96 50.31,2.96 51.43,4.08 51.43,5.51 50.41,6.53 50.01,6.53 PIC33.4 50.92,6.12 52.45,7.65 v52.45,10.92 | 25.92,10.41 27.14,10.41 OK2.12 | 25.92,10.41 25.92,10.51 25.41,11.02 25.41,12.25 26.02,12.86 27.14,12.86 OK2.14 27.25,12.96 28.17,13.88 28.17,14.49 27.25,15.41 OK2.16 27.14,15.51 27.04,15.61 v26.02,15.61 | PR1.2 69.29,21.23 66.13,21.23 65.41,20.51 PC2.+ 65.31,20.51 v61.94,20.51 | ENC.28 55.21,42.66 56.02,42.66 56.23,42.45 56.23,41.02 56.02,40.82 55.21,40.82 ENC.25 55.11,40.72 54.29,40.72 53.98,40.41 53.98,37.25 54.29,36.94 54.29,36.84 | 54.29,36.84 53.98,36.53 53.98,34.59 54.29,34.29 55.11,34.29 ENC.15 54.7,34.19 v54.7,33.47 | 54.29,36.84 55.11,36.84 ENC.19 55.11,36.94 55.11,37.45 ENC.20 | ER2.2 45.82,30.92 47.76,30.92 ER1.2 47.55,31.02 v47.55,32.25 | v63.48,39.49 63.17,39.19 62.25,39.19 EL1.1
  Bottom 0.254: BLS.1 56.33,92.05 62.66,92.05 63.48,92.86 72.15,92.86 79.7,85.31 SV3.1 79.8,85.21 81.64,83.38 81.64,74.8 79.8,72.97 79.8,72.76 SV2.1 79.7,72.66 79.7,71.84 69.8,61.94 WIFI.VCC 69.7,61.74 68.58,61.74 67.66,60.82 64.7,60.82 64.65,60.87 | 64.65,60.87 64.7,60.92 64.7,61.74 WIFI.CH_PD | 64.65,60.87 63.48,59.7 v63.48,39.49 63.37,39.49 56.13,32.25 54.7,32.25 | 54.7,32.25 54.49,32.25 | 54.49,32.25 v47.55,32.25 | 54.7,32.25 v54.7,33.47 | 54.49,32.25 54.49,27.86 54.9,27.45 55.01,27.45 v61.94,20.51 61.94,20.41 v52.45,10.92 | v26.02,15.61 v22.04,19.59
A0  (via drill 0.35)
  Top 0.203: SV3.2 79.7,87.66 79.5,87.46 75.31,87.46 NIR3.1 75.21,87.36 74.29,86.44 74.29,83.89 71.03,80.62 66.64,80.62 66.54,80.72 v64.9,80.72 | v60.31,76.13 60.31,75.62 60.72,75.21 60.72,74.91 MC.23
  Bottom 0.203: v64.9,80.72 v60.31,76.13
A1  (via drill 0.35)
  Top 0.203: v19.59,29.29 16.02,32.86 10.92,32.86 IR1.3 | v21.74,27.25 21.43,27.25 20.82,26.64 OK1.13 | v28.37,33.68 29.7,33.68 IL2.A | v59.49,75.31 60.21,74.6 60.21,74.39 MC.24 | v37.76,51.43 v56.94,70.62
  Bottom 0.203: v19.59,29.29 21.64,27.25 v21.74,27.25 28.17,33.68 v28.37,33.68 28.37,34.59 37.76,43.98 v37.76,51.43 | v59.49,75.31 59.49,74.91 56.94,72.35 v56.94,70.62
A2  (via drill 0.35)
  Top 0.203: v20.82,16.33 15.92,16.33 15.61,16.02 10.92,16.02 IR2.4 | v26.12,14.49 26.84,14.49 27.14,14.19 OK2.15 | v28.47,17.04 28.98,16.53 29.7,16.53 IL5.A | v55.01,80.21 55.01,77.76 60.21,72.56 60.21,72.25 MC.25
  Bottom 0.203: 26.02,14.59 24.29,16.33 v20.82,16.33 18.88,18.27 18.88,30.72 22.25,34.09 22.25,48.07 54.39,80.21 v55.01,80.21 | 26.02,14.59 v28.47,17.04 | 26.02,14.59 v26.12,14.49
A3  (via drill 0.35)
  Top 0.203: v14.39,15.21 10.92,15.21 IR2.3 | v26.12,11.94 26.94,11.94 27.14,11.74 OK2.13 28.27,12.65 29.7,12.65 IL6.A | v62.15,72.05 61.43,72.05 61.03,71.64 60.82,71.64 MC.26 | v62.15,67.15 61.03,67.15 v52.15,58.27
  Bottom 0.203: v14.39,15.21 15.41,15.21 16.12,15.92 20.21,15.92 24.19,11.94 v26.12,11.94 31.43,6.63 32.04,6.63 32.45,7.04 32.45,38.06 52.15,57.76 v52.15,58.27 | v62.15,67.15 v62.15,72.05
A4
  Top 0.203: 56.48,74.65 59.19,71.94 59.19,71.84 60.41,70.62 60.92,70.62 61.33,71.03 MC.27 | 56.48,74.65 55.92,75.21 R1.1 | 56.48,74.65 55.11,73.27 55.11,72.05 54.6,71.54 48.27,71.54 35.1,58.37 34.09,58.37 BL1.1
A5
  Top 0.203: MC.28 61.84,70.42 61.54,70.11 60.31,70.11 57.96,72.46 55.92,72.46 R3.1 55.92,72.35 55.92,72.25 54.8,71.13 50.31,71.13 37.55,58.37 36.64,58.37 BL1.2
A6  (via drill 0.35)
  Top 0.203: 19.54,30.36 20.72,29.19 OK1.15 | 19.54,30.36 16.23,33.68 10.92,33.68 IR1.4 | v26.64,37.45 29.7,37.45 IL1.A | v19.59,30.41 19.54,30.36 | v58.98,80.21 60.41,80.21 60.62,80.01 60.62,79.8 62.97,77.46 62.97,77.15 MC.19
  Bottom 0.203: v19.59,30.41 v26.64,37.45 35.1,45.92 35.1,58.37 56.94,80.21 v58.98,80.21
A7
  Top 0.203: MC.22 61.43,75.42 62.97,73.88 64.9,73.88 65.31,74.29 65.31,78.17 65.62,78.48 65.62,79.19 65.21,79.6 65.01,79.6 64.19,80.42 64.19,81.03 64.39,81.23 64.39,84.8 63.98,85.21 63.37,85.21 63.07,84.91 55.82,84.91 TR.2 55.72,84.8 55.41,84.8 47.05,76.44 17.96,76.44 THM.2
AREF
  Top 0.203: C1.2 59.9,79.19 62.45,76.64 MC.20
BLV  (via drill 0.35)
  Top 0.203: R3.2 54.19,72.56 54.19,75.21 R1.2 54.19,75.31 54.19,79.19 C3.1 54.19,79.29 54.19,81.95 R2.2 54.29,81.95 55.72,83.38 v58.78,83.38 60.62,83.38 62.76,81.23 62.76,78.78 63.58,77.97 63.58,77.76 MC.18 63.68,77.66 64.6,76.74 v64.6,74.6 | 67.71,71.08 68.17,71.54 68.68,71.54 69.09,71.13 MC.6 | 67.71,71.08 67.56,70.92 67.56,70.62 67.97,70.21 67.97,70.01 MC.4 | v66.23,72.56 67.71,71.08
  Bottom 0.203: 58.78,91.03 63.17,91.03 63.37,91.23 BL.2 | 58.78,91.03 55.21,91.03 54.29,91.95 48.78,91.95 BLS.2 | v66.23,72.56 66.23,72.97 v64.6,74.6 | v58.78,83.38 58.78,91.03
COM1
  Top 0.203: OK1.2 14.29,29.08 15.1,28.27 15.1,27.45 14.29,26.64 OK1.4 14.29,26.53 15.1,25.72 15.1,25 14.29,24.19 OK1.6 14.29,24.08 15.1,23.27 15.1,22.45 14.29,21.64 OK1.8 14.19,21.64 9.49,21.64 6.33,24.8 3.57,24.8 2.75,25.61 2.75,39.19 4.9,41.33 XI1.1
COM2
  Top 0.203: OK2.8 20.82,6.63 21.64,7.45 21.64,8.27 20.82,9.08 OK2.6 20.82,9.18 21.64,10 21.64,10.82 20.82,11.63 OK2.4 20.82,11.74 21.64,12.55 21.64,13.27 20.82,14.08 OK2.2 20.82,14.19 21.64,15 21.64,16.53 21.12,17.04 10.82,17.04 7.55,20.31 5,20.31 XI2.1
D2  (via drill 0.35)
  Top 0.203: v54.29,58.27 64.19,68.17 MC.32 | v47.25,43.58 46.74,43.06 46.74,41.13 47.05,40.82 47.86,40.82 ENC.4
  Bottom 0.203: v54.29,58.27 54.29,50.62 v47.25,43.58
D3  (via drill 0.35)
  Top 0.203: v63.58,60.82 65.11,60.82 65.72,61.43 65.72,61.74 66.84,62.86 67.15,62.86 68.27,63.98 68.27,65.92 66.33,67.86 66.33,68.17 MC.1
  Bottom 0.203: v63.58,60.82 63.17,60.82 62.25,61.74 WIFI.TX
D4
  Top 0.203: MC.2 66.94,68.78 66.94,68.48 69.7,65.72 69.7,64.39 WIFI.RX
D5  (via drill 0.35)
  Top 0.203: IR2.1 10.82,13.47 10.61,13.47 10.1,12.96 9.18,12.96 7.25,14.9 7.25,17.14 5.31,19.08 3.47,19.08 2.75,19.8 2.75,20.92 3.47,21.64 8.88,21.64 13.06,17.45 21.33,17.45 24.9,13.88 24.9,8.88 27.14,6.63 OK2.9 27.25,6.53 28.47,5.31 29.7,5.31 IL8.A 29.8,5.21 29.8,4.8 30.82,3.78 v30.82,3.47 | v81.03,44.19 81.03,61.74 73.88,68.88 73.88,70.11 70.31,73.68 70.31,74.29 MC.9
  Bottom 0.203: v81.03,44.19 82.66,42.55 82.66,20.61 65.01,2.96 46.64,2.96 45.82,3.78 35.92,3.78 35.62,3.47 v30.82,3.47
D6  (via drill 0.35)
  Top 0.203: v12.45,14.29 10.92,14.29 IR2.2 | v26.23,9.7 26.64,9.7 27.14,9.18 OK2.11 27.25,9.08 29.7,9.08 IL7.A | v68.78,73.99 69.6,74.8 MC.10 | v67.05,66.13 67.05,65.52 65.72,64.19 65.72,63.98 64.6,62.86 64.39,62.86 63.17,61.64 63.17,61.43 60.01,58.27 v56.33,58.27
  Bottom 0.203: v12.45,14.29 17.04,9.7 v26.23,9.7 29.7,6.22 32.25,6.22 32.86,6.84 32.86,37.86 53.98,58.98 54.6,58.98 55.31,58.27 v56.33,58.27 | v68.78,73.99 68.78,67.86 v67.05,66.13
D7  (via drill 0.35)
  Top 0.203: 14.75,31.18 18.98,26.94 18.98,22.76 20.1,21.64 20.72,21.64 OK1.9 20.82,21.53 21.02,21.33 v21.02,20.72 | 14.75,31.18 14.7,31.23 10.92,31.23 IR1.1 | v26.23,25.92 29.7,25.92 IL4.A | v70.11,76.44 69.19,75.52 MC.11 | v70.72,81.33 70.72,83.58 68.37,85.93 v62.35,85.93 | 14.75,31.18 v14.9,31.33
  Bottom 0.203: v21.02,20.72 v26.23,25.92 | v70.11,76.44 70.11,80.72 v70.72,81.33 | v62.35,85.93 57.35,80.93 54.49,80.93 14.9,41.33 v14.9,31.33
D8
  Top 0.203: 22.71,22.3 20.82,24.19 OK1.11 | 22.71,22.3 22.76,22.25 22.76,19.29 22.35,18.88 21.74,18.88 21.33,19.29 21.33,19.9 21.74,20.31 21.74,21.84 21.43,22.14 20.21,22.14 19.39,22.96 19.39,27.86 15.21,32.04 10.92,32.04 IR1.2 | 32.71,26.79 32.76,26.74 32.76,25.31 31.02,23.57 23.98,23.57 22.71,22.3 | 32.71,26.79 29.8,29.7 29.8,29.9 IL3.A | MC.12 68.58,76.03 69.7,77.15 70.42,77.15 74.29,73.27 74.29,69.09 81.84,61.54 81.84,29.29 80.82,28.27 77.25,28.27 75.82,26.84 32.76,26.84 32.71,26.79
D9
  Top 0.203: SV2.2 79.7,75.21 79.39,74.91 75.31,74.91 NIR2.1 75.21,74.91 72.56,77.56 69.19,77.56 68.27,76.64 68.07,76.64 MC.13
D10  (via drill 0.35)
  Top 0.203: 46.18,37.4 46.23,37.45 47.86,37.45 ENC.9 | 46.18,37.4 45.41,36.64 45.41,34.7 45.72,34.39 45.72,32.66 ER2.1 | v67.05,73.99 67.05,76.54 67.35,76.84 67.35,77.05 MC.14 | v66.03,67.15 63.17,64.29 63.17,63.58 62.45,62.86 59.9,62.86 53.88,56.84 v53.58,56.84 | v45.21,48.47 45.21,38.37 46.18,37.4
  Bottom 0.203: v67.05,73.99 67.05,68.17 v66.03,67.15 | v45.21,48.47 v53.58,56.84
D11  (via drill 0.35)
  Top 0.203: v68.88,79.5 67.15,77.76 66.94,77.76 MC.15 | v45.92,39.59 46.64,38.88 47.86,38.88 ENC.7 | v61.33,66.44 v57.05,62.15
  Bottom 0.203: BL.4 66.03,91.33 67.05,92.36 68.99,92.36 70.31,91.03 70.31,81.95 68.88,80.52 v68.88,79.5 67.66,78.27 67.25,78.27 61.33,72.35 v61.33,66.44 | v45.92,39.59 45.92,41.23 57.05,52.35 v57.05,62.15
D12  (via drill 0.35)
  Top 0.203: 67.3,79.04 68.48,80.21 77.05,80.21 81.64,84.8 81.64,88.17 80.72,89.09 69.7,89.09 68.99,89.8 64.5,89.8 63.48,88.78 BL.1 | 67.3,79.04 66.64,78.37 66.33,78.37 MC.16 | v46.33,48.58 46.33,40.21 47.05,39.49 47.86,39.49 ENC.6 | v50.62,52.86 50.62,61.43 v58.78,69.6 | v67.35,78.99 67.3,79.04
  Bottom 0.203: v50.62,52.86 v46.33,48.58 | v58.78,69.6 58.78,70.42 v67.35,78.99
D13  (via drill 0.35)
  Top 0.203: 64.19,78.89 64.19,79.8 63.68,80.31 v63.68,84.5 | 64.19,78.89 64.19,78.37 MC.17 | v54.19,25.31 69.29,25.31 R6.1 | v46.53,38.17 47.86,38.17 ENC.8 | v64.9,78.89 64.19,78.89 | v57.66,69.9 57.66,69.09 49.9,61.33 v49.9,50.01
  Bottom 0.203: v63.68,84.5 63.68,86.44 65.92,88.68 BL.3 | v54.19,25.31 53.47,25.31 46.84,31.94 46.84,35.41 | 46.84,35.41 47.25,35.82 47.25,37.45 v46.53,38.17 | v64.9,78.89 64.9,77.15 v57.66,69.9 | v49.9,50.01 49.9,47.25 45.21,42.55 45.21,36.43 46.23,35.41 46.84,35.41
DTR
  Top 0.203: C2.2 59.8,81.95 59.49,81.95 57.76,80.21 57.56,80.21 57.15,79.8 57.15,76.54 60.41,73.27 70.11,73.27 73.48,69.9 73.48,68.68 73.58,68.58 73.58,56.43 72.25,55.11 PP.1
EP4  (via drill 0.35)
  Top 0.203: ERN1.7 61.13,33.17 61.13,33.88 ERN1.8 61.13,33.98 64.7,33.98 66.33,35.62 U$2.P4 | EC4.1 56.43,32.35 57.25,32.35 62.15,37.25 EL1.2 62.25,37.25 63.07,36.43 v64.5,36.43
  Bottom 0.203: v64.5,36.43 65.21,35.72 66.33,35.72 U$2.P4
EP5  (via drill 0.35)
  Top 0.203: ERN1.4 59.9,31.64 59.9,32.35 ERN1.3 59.8,32.35 58.98,32.35 v58.88,32.25 | EC5.1 56.43,29.59 68.07,29.59 70.42,31.94 70.42,35.51 68.99,36.94 U$2.P5
  Bottom 0.203: v58.88,32.25 59.29,32.25 64.19,37.15 68.78,37.15 68.88,37.04 U$2.P5
GND  (via drill 0.35)
  Top 0.254: SV2.3 79.8,77.76 79.8,82.25 82.15,84.6 82.15,88.38 80.31,90.21 79.8,90.21 SV3.3 79.7,90.31 69.5,90.31 68.58,91.23 BL.6 68.48,91.33 67.35,92.46 61.84,92.46 54.29,84.91 53.98,84.91 TR.1 | 68.37,68.88 68.17,68.88 67.76,69.29 67.45,69.29 MC.3 67.35,69.39 66.94,69.8 66.44,69.8 65.21,68.58 65.21,67.35 62.25,64.39 WIFI.GND | 68.37,68.88 68.99,69.5 68.99,70.01 68.58,70.42 MC.5 | 70.92,66.23 71.64,66.23 72.15,66.74 72.15,67.45 Q1.2 | 70.92,66.23 68.37,68.78 68.37,68.88 | MC.21 61.84,76.03 61.43,76.44 61.23,76.44 58.48,79.19 58.17,79.19 C1.1 58.17,79.09 58.17,78.37 v57.86,78.07 | v55.92,77.86 55.92,79.19 C3.2 | ENC.22 55.11,38.78 55.11,38.27 ENC.21 55.21,38.17 55.92,38.17 56.23,37.86 56.23,36.02 | 56.23,36.02 56.13,36.02 56.02,36.13 55.21,36.13 ENC.18 | 56.23,36.02 57.86,36.02 58.78,36.94 59.09,36.94 EC1.2 59.19,37.04 59.19,37.35 61.23,39.39 61.23,39.7 62.45,40.92 66.23,40.92 U$2.GND 66.33,40.82 66.33,43.06 63.88,45.51 61.84,45.51 61.64,45.31 61.64,42.96 59.19,40.51 59.19,39.59 EC2.2 | 70.92,66.23 70.92,56.13 70.31,55.52 70.31,54.39 72.15,52.56 PP.2 | v50.01,3.67 50.01,4.8 PIC33.5 | v51.64,7.86 50.31,7.86 50.01,8.16 PIC33.3 | IR4.4 24.59,22.96 25.31,22.96 IR4.3 25.41,22.96 26.12,22.96 IR4.2 26.23,22.96 26.94,22.96 IR4.1 27.04,22.86 31.84,22.86 34.29,20.41 43.27,20.41 44.8,21.94 PC1.- 45,22.04 48.27,25.31 52.56,25.31 52.96,24.9 52.96,21.53 51.33,19.9 51.33,19.39 PD2.A 51.23,19.18 51.64,18.78 v51.64,17.45 | IR2.8 9.7,13.57 9.7,14.29 IR2.7 9.7,14.39 9.7,15.1 IR2.6 9.7,15.21 9.7,15.92 IR2.5 9.59,16.02 v9.59,17.25 | v9.59,30.41 9.59,31.23 IR1.8 9.7,31.33 9.7,32.04 IR1.7 9.7,32.15 9.7,32.86 IR1.6 9.7,32.96 9.7,33.68 IR1.5 9.59,33.78 9.59,45.62 5,50.21 5,51.13 XV.1
  Top 0.254: IR3.4 23.88,31.33 23.88,32.04 IR3.3 23.88,32.15 23.88,32.86 IR3.2 23.88,32.96 23.88,33.68 IR3.1 23.98,33.78 23.98,34.39 | 23.98,34.39 23.98,41.53 35.26,52.81 | 35.26,52.81 35.41,52.96 35.41,54.6 36.53,55.72 BL1.4 | 53.93,31.58 EC4.2 | 53.93,31.58 53.37,31.02 53.17,31.02 ER10.2 53.27,30.92 54.6,29.59 EC5.2 54.7,29.49 54.9,29.49 55.92,28.47 72.15,28.47 72.25,28.57 U$2.SHIELD1 | 48.98,36.53 48.68,36.23 47.96,36.23 ENC.11 | 48.98,36.53 48.98,41.74 48.73,41.99 | 48.73,41.99 48.68,42.05 47.96,42.05 ENC.2 | 48.73,41.99 52.56,45.82 52.56,46.94 EC3.- 52.45,46.94 50.11,49.29 38.78,49.29 35.26,52.81 | 48.98,36.53 53.93,31.58 | 75.31,22.25 75.31,25.21 INDL.C 75.42,25.21 81.23,25.21 81.44,25.41 SR.2 | 75.31,22.25 75.31,21.33 PL.C 75.42,21.23 80.93,15.72 81.95,15.72 PJ1.GND | 75.31,22.25 62.66,22.25 60.92,20.51 57.15,20.51 PC2.- 57.05,20.61 v55.11,22.55 | 23.98,34.39 v21.53,34.39
  Bottom 0.254: WIFI.GND 62.15,64.39 55.92,70.62 v55.92,77.86 56.02,77.86 56.23,78.07 v57.86,78.07 58.27,78.07 67.15,86.95 67.15,88.89 68.48,90.21 68.48,91.23 BL.6 | 74.19,45.92 74.19,50.52 72.25,52.45 PP.2 | 74.19,45.92 72.35,44.09 U$2.SHIELD2 72.15,44.09 69.7,44.09 66.44,40.82 U$2.GND | v50.01,3.67 50.01,6.22 v51.64,7.86 v51.64,17.45 51.64,21.43 51.53,21.53 51.53,22.14 51.94,22.55 v55.11,22.55 | v9.59,17.25 v9.59,30.41 17.55,30.41 v21.53,34.39 | 81.84,28.27 81.84,25.82 81.54,25.51 SR.2 | 81.84,28.27 81.84,30.11 80.93,31.02 80.93,32.15 U$2.G- 80.82,32.35 80.82,40.31 U$2.Y- 80.82,40.51 80.82,40.92 75.82,45.92 74.19,45.92 | 81.84,28.27 78.37,28.27 77.66,27.55 73.99,27.55 72.97,28.57 72.35,28.57 U$2.SHIELD1
  pour Bottom (isolate 0.305): -0.76,97.1 85.22,97.1 85.22,-0.64 -0.76,-0.64
  pour Top (isolate 0.305): -0.27,96.77 85.09,96.77 85.09,-0.25 -0.27,-0.25
  cutout Top (no thermals): 21.59,80.14 21.59,70.87 20.7,69.98 14.99,69.98 14.22,70.74 14.22,80.01 15.11,80.9 20.83,80.9
  cutout Bottom (no thermals): 8.64,94.49 27.43,94.49 28.32,93.6 28.32,63.25 27.56,62.48 8.51,62.48 7.62,63.37 7.62,93.47
LEDA
  Top 0.203: ER3.1 57.25,47.45 69.9,47.45 71.84,45.51 78.27,45.51 80.82,42.96 U$2.Y+
LEDB
  Top 0.203: ER4.1 57.25,45.31 57.96,45.31 58.68,46.02 64.5,46.02 80.82,29.7 U$2.G+
N$2
  Top 0.203: PD1.C 65.82,4.29 65.82,8.47 PF1.1
N$5
  Top 0.203: R6.2 71.23,25.31 73.17,25.31 INDL.A
N$9
  Top 0.203: ER3.2 55.31,47.45 55.31,46.74 53.98,45.41 53.98,42.45 54.29,42.15 55.11,42.15 ENC.27
N$10
  Top 0.203: MC.8 70.31,72.15 70.31,71.94 71.54,70.72 71.54,70.1 | 71.54,70.1 71.54,69.94 72.37,69.11 | Q1.3 72.37,69.11 | 72.37,69.11 73.03,68.45 | 71.54,70.1
N$11
  Top 0.203: PR1.1 71.23,21.23 73.17,21.23 PL.A
N$12
  Top 0.203: IR3.8 25.21,33.78 27.45,33.78 30.21,36.53 30.82,36.53 31.74,37.45 IL1.C
N$13
  Top 0.203: ENC.1 47.96,42.76 47.96,45.11 49.8,46.94 EC3.+
N$14  (via drill 0.35)
  Top 0.203: v55.31,43.58 55.31,45.21 ER4.2 | v53.78,41.64 54.09,41.64 54.29,41.43 55.11,41.43 ENC.26
  Bottom 0.203: v55.31,43.58 55.31,43.17 v53.78,41.64
N$15
  Top 0.203: MC.7 69.7,71.54 70.11,71.13 70.11,68.07 Q1.1
N$16  (via drill 0.35)
  Top 0.203: v52.35,11.94 50.41,10 50.01,10 PIC33.2 | PD2.C 51.33,23.68 52.25,22.76 v52.25,21.84 50.92,21.84 49.7,20.61 49.7,17.45 45.51,13.27 45.51,8.78 PCO.P$2
  Bottom 0.203: v52.35,11.94 52.35,21.74 v52.25,21.84
N$17
  Top 0.203: ER1.1 49.6,31.02 49.6,31.23 47.15,33.68 47.05,33.68 45.82,34.9 45.82,36.43 46.23,36.84 47.86,36.84 ENC.10
N$18
  Top 0.203: IIR1.1 9.59,27.76 9.59,29.39 7.65,31.33 7.65,34.9 XI1.2
N$19
  Top 0.203: ER10.1 51.33,31.02 51.13,31.02 47.96,34.19 ENC.14
N$20
  Top 0.203: IR3.7 25.21,32.86 28.88,32.86 28.98,32.76 30.82,32.76 31.74,33.68 IL2.C
N$21
  Top 0.203: IR3.6 25.21,32.04 29.7,32.04 31.74,30 IL3.C
N$22
  Top 0.203: ENC.24 55.21,40.11 55.92,40.11 56.43,39.59 57.25,39.59 EC2.1 57.35,39.59 57.35,41.74 59.09,43.47 Q2.1
N$23
  Top 0.203: IR3.5 25.21,31.23 26.53,31.23 31.74,26.02 IL4.C
N$24
  Top 0.203: 57.2,38.12 56.23,39.09 56.23,39.19 56.02,39.39 55.21,39.39 ENC.23 | 57.2,38.12 57.25,38.06 57.25,37.04 EC1.1 | 57.2,38.12 57.25,38.17 59.29,38.17 60.72,39.59 60.72,41.33 62.86,43.47 Q2.2
N$25
  Top 0.203: IR4.8 27.04,21.53 27.04,21.23 31.74,16.53 IL5.C
N$26
  Top 0.203: IR4.7 26.23,21.53 26.23,18.27 30.41,14.08 30.61,14.08 31.74,12.96 31.74,12.76 IL6.C
N$27
  Top 0.203: IR4.6 25.41,21.53 25.41,18.47 30.21,13.68 30.41,13.68 30.82,13.27 30.82,10 31.74,9.08 IL7.C
N$28
  Top 0.203: IIR1.2 9.59,26.94 9.29,26.94 7.25,28.98 7.25,31.43 5,33.68 XI1.3
N$29
  Top 0.203: IIR1.8 10.92,27.76 11.53,27.76 14.19,30.41 OK1.1
N$30
  Top 0.203: IIR1.7 10.92,26.94 13.27,26.94 14.19,27.86 OK1.3
N$31
  Top 0.203: IIR1.6 10.92,26.02 13.57,26.02 14.19,25.41 OK1.5
N$32
  Top 0.203: IIR1.5 10.92,25.21 11.84,25.21 14.19,22.86 OK1.7
N$33
  Top 0.203: IIR1.3 9.59,26.12 8.78,26.12 5,29.9 XI1.4
N$34
  Top 0.203: IIR1.4 9.59,25.31 5.82,25.31 XI1.5
N$36
  Top 0.203: IIR2.1 9.59,10 9.59,11.94 5,16.53 XI2.2
N$37
  Top 0.203: IIR2.8 10.92,10 10.92,10.71 16.12,15.92 20.21,15.92 20.72,15.41 OK2.1
N$38
  Top 0.203: IIR2.2 9.59,9.18 8.47,9.18 5,12.65 XI2.3
N$39
  Top 0.203: IIR2.7 10.92,9.18 17.04,9.18 20.72,12.86 OK2.3
N$40
  Top 0.203: IIR2.3 9.59,8.37 5.51,8.37 5,8.88 XI2.4
N$41
  Top 0.203: IIR2.6 10.92,8.37 14.39,8.37 14.8,8.78 19.18,8.78 20.72,10.31 OK2.5
N$42
  Top 0.203: IIR2.4 9.59,7.45 7.25,7.45 5,5.21 XI2.5
N$43
  Top 0.203: IIR2.5 10.92,7.55 14.19,7.55 14.7,8.06 20.51,8.06 20.72,7.86 OK2.7
N$44  (via drill 0.35)
  Top 0.203: v25.61,13.47 25.61,13.78 24.59,14.8 24.59,21.53 IR4.5 | v31.74,7.35 31.74,5.31 IL8.C
  Bottom 0.203: v31.74,7.35 v25.61,13.47
RAW_IV
  Top 0.254: 53.47,14.08 63.58,14.08 64.6,13.06 64.6,12.14 66.23,10.51 68.78,10.51 70.72,8.57 PF1.2 | 53.47,14.08 52.96,14.08 50.62,11.74 50.01,11.74 PIC33.1 | 53.47,14.08 53.47,25.1 52.76,25.82 44.8,25.82 41.02,22.04 36.64,22.04 PC1.+
RD+  (via drill 0.35)
  Top 0.203: ERN1.6 61.13,32.45 63.78,32.45 65.72,34.39 68.88,34.39 U$2.RD+ | v55.21,28.17 54.49,28.17 52.35,30.31 52.35,31.53 48.98,34.9 47.96,34.9 ENC.13
  Bottom 0.203: v55.21,28.17 62.86,28.17 68.88,34.19 68.88,34.39 U$2.RD+
RD-  (via drill 0.35)
  Top 0.203: v62.56,31.64 61.13,31.64 ERN1.5 | v46.53,36.13 47.05,35.62 47.86,35.62 ENC.12 | v62.76,40.21 64.39,40.21 66.33,38.27 U$2.RD-
  Bottom 0.203: v62.56,31.64 63.48,31.64 66.54,34.7 67.86,34.7 69.09,35.92 69.29,35.92 70.01,36.64 70.01,37.35 69.19,38.17 66.44,38.17 U$2.RD- | v46.53,36.13 46.53,37.15 45.82,37.86 45.82,38.47 47.55,40.21 v62.76,40.21
RESET  (via drill 0.35)
  Top 0.203: R2.1 55.92,82.05 58.07,82.05 C2.1 58.17,82.05 58.48,82.05 59.39,82.97 60.41,82.97 62.05,81.33 v62.05,80.82 | v58.07,71.33 59.85,69.55 | 59.85,69.55 59.9,69.5 61.84,69.5 62.25,69.9 62.45,69.9 MC.29 | v70.42,41.13 70.01,41.13 64.6,46.53 56.64,46.53 56.13,47.05 56.13,52.66 51.02,57.76 51.02,60.72 59.85,69.55
  Bottom 0.203: v58.07,71.33 58.07,72.86 64.19,78.99 64.19,79.19 65.01,80.01 65.62,80.01 | 65.62,80.01 67.76,80.01 69.9,82.15 69.9,87.36 68.58,88.68 BL.5 | v62.05,80.82 63.98,80.82 64.6,81.44 65.21,81.44 65.62,81.03 65.62,80.01 | v70.42,41.13 70.42,28.47 71.74,27.14 73.68,27.14 79.8,21.02 81.44,21.02 SR.1
RXI  (via drill 0.35)
  Top 0.203: v64.39,69.8 63.78,69.8 63.37,69.39 63.07,69.39 MC.30 | v68.37,62.45 68.37,54.09 71.33,51.13 73.48,51.13 74.09,50.52 74.09,49.29 72.25,47.45 PP.4
  Bottom 0.203: v64.39,69.8 64.39,67.76 66.74,65.41 67.66,65.41 68.37,64.7 v68.37,62.45
TD+
  Top 0.203: 65.67,36.28 66.13,36.74 67.76,36.74 69.09,35.41 69.39,35.41 70.01,34.8 70.01,32.96 68.99,31.94 U$2.TD+ | 65.67,36.28 65.11,35.72 61.84,35.72 60.11,33.98 59.9,33.98 ERN1.1 | 65.67,36.28 63.88,38.06 61.43,38.06 61.33,37.96 61.33,37.66 59.19,35.51 55.21,35.51 ENC.17
TD-
  Top 0.203: 57.81,32.2 56.94,31.33 55.82,31.33 55.62,31.53 55.62,33.37 56.23,33.98 56.23,34.59 55.92,34.9 55.21,34.9 ENC.16 | 57.81,32.2 58.68,33.06 59.8,33.06 ERN1.2 | 57.81,32.2 59.09,30.92 62.86,30.92 65.01,33.06 66.33,33.06 U$2.TD-
TXO
  Top 0.203: MC.31 63.58,68.78 63.37,68.78 62.45,67.86 60.72,67.86 51.43,58.58 51.43,57.96 59.39,50.01 72.15,50.01 PP.3
VIN
  Top 0.203: PJ1.VIN0 81.95,4.39 80.52,5.82 74.29,5.82 72.76,4.29 70.21,4.29 PD1.A 70.11,4.18 67.35,1.43 5.92,1.43 2.35,5 2.35,41.53 4.9,44.09 4.9,47.25 XV.2
WFGPIO0
  Bottom 0.203: WIFI.GPIO0 67.25,64.29 66.03,64.29 64.6,62.86 46.23,62.86 36.64,53.27 BL1.6
WFGPIO2  (via drill 0.35)
  Top 0.203: v43.47,63.27 43.06,63.27 36.64,56.84 36.13,56.84 35.1,55.82 35.1,55.01 34.09,53.98 34.09,53.27 BL1.5
  Bottom 0.203: v43.47,63.27 62.86,63.27 63.88,64.29 64.7,64.29 WIFI.GPIO2

### Text on the board
tPlace: ON | Edge MIN | IOTECH © 2019 | IOTB v2.9 TOP | S/N: | www.iotech.com.tr
bPlace: IOTB BOT | IOTECH | MIN
bNames: C:/Users/celikada/Downloads/5.bmp